# EAGLE design shield2 (EAGLE 6.1)
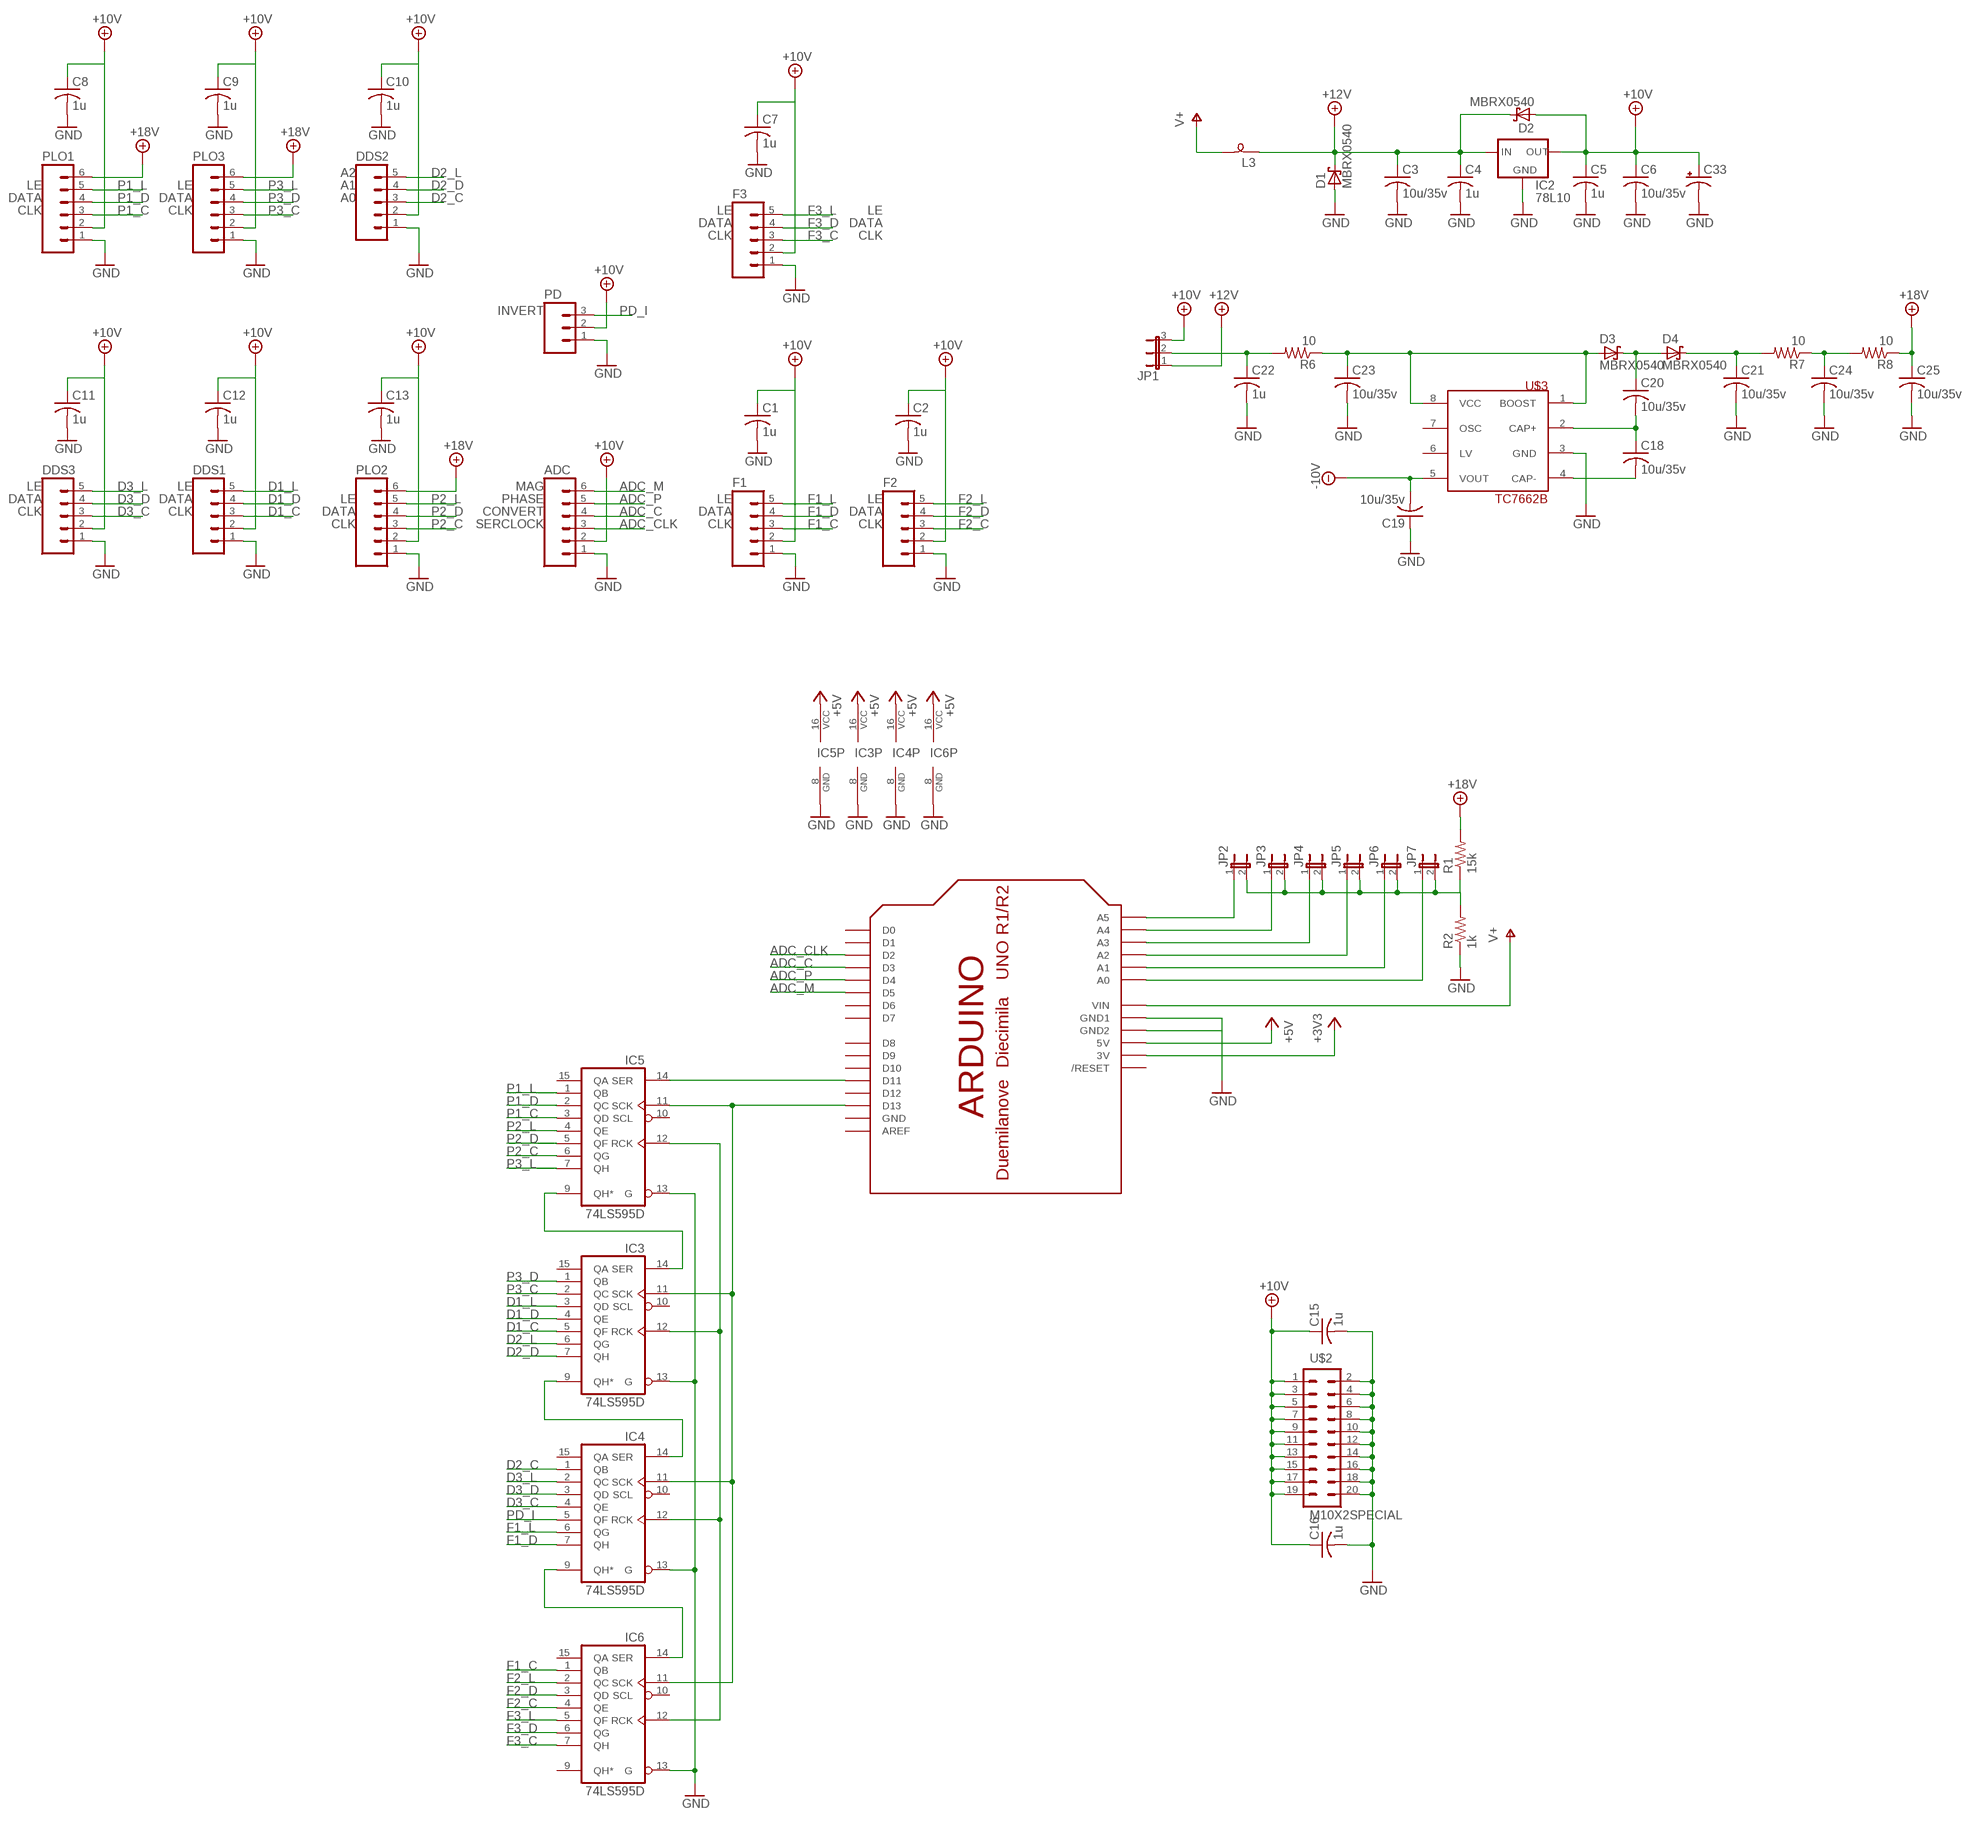
[diagram p0: schematic, sheet 1]

## Parts
ADC  M06LOCK  [1X06_LOCK]
C1  1u  C-USC0603  [C0603]
C2  1u  C-USC0603  [C0603]
C3  10u/35v  C-USC1206  [C1206]
C4  1u  C-USC0603  [C0603]
C5  1u  C-USC0603  [C0603]
C6  10u/35v  C-USC1206  [C1206]
C7  1u  C-USC0603  [C0603]
C8  1u  C-USC0603  [C0603]
C9  1u  C-USC0603  [C0603]
C10  1u  C-USC0603  [C0603]
C11  1u  C-USC0603  [C0603]
C12  1u  C-USC0603  [C0603]
C13  1u  C-USC0603  [C0603]
C15  1u  C-USC0603  [C0603]
C16  1u  C-USC0603  [C0603]
C18  10u/35v  C-USC1206  [C1206]
C19  10u/35v  C-USC1206  [C1206]
C20  10u/35v  C-USC1206  [C1206]
C21  10u/35v  C-USC1206  [C1206]
C22  1u  C-USC0603  [C0603]
C23  10u/35v  C-USC1206  [C1206]
C24  10u/35v  C-USC1206  [C1206]
C25  10u/35v  C-USC1206  [C1206]
C33  CPOL-USE2.5-6  [E2,5-6]
D1  MBRX0540  [SOD323-R]
D2  MBRX0540  [SOD323-R]
D3  MBRX0540  [SOD323-R]
D4  MBRX0540  [SOD323-R]
DDS1  M05LOCK  [1X05_LOCK]
DDS2  M05LOCK  [1X05_LOCK]
DDS3  M05LOCK  [1X05_LOCK]
F1  M05LOCK  [1X05_LOCK]
F2  M05LOCK  [1X05_LOCK]
F3  M05LOCK  [1X05_LOCK]
IC2  78L10  78XXS  [78XXS]
IC3  74LS595D  [SO16]
IC4  74LS595D  [SO16]
IC5  74LS595D  [SO16]
IC6  74LS595D  [SO16]
JP1  JP2E  [JP2]
JP2  JUMPER-2SMD-NO  [SJ_2S-NO]
JP3  JUMPER-2SMD-NO  [SJ_2S-NO]
JP4  JUMPER-2SMD-NO  [SJ_2S-NO]
JP5  JUMPER-2SMD-NO  [SJ_2S-NO]
JP6  JUMPER-2SMD-NO  [SJ_2S-NO]
JP7  JUMPER-2SMD-NO  [SJ_2S-NO]
L3  SM-B5  [SM-B5]
PD  M03LOCK  [1X03_LOCK]
PLO1  M06LOCK  [1X06_LOCK]
PLO2  M06LOCK  [1X06_LOCK]
PLO3  M06LOCK  [1X06_LOCK]
R1  15k  R-US_R0603  [R0603]
R2  1k  R-US_R0603  [R0603]
R6  10  R-US_R0603  [R0603]
R7  10  R-US_R0603  [R0603]
R8  10  R-US_R0603  [R0603]
U$1  ARDUINO-NOHOLE  [ARDUINO-NOHOLE]
U$2  M10X2SPECIAL  [2X10_LOCK_SPECIAL]
U$3  TC7662B  [SO-08]

## Nets
+3V3: U$1.3V
+5V: IC3.16(VCC) IC4.16(VCC) IC5.16(VCC) IC6.16(VCC) U$1.5V
+10V: ADC.2 C1.1 C2.1 C5.1 C6.1 C7.1 C8.1 C9.1 C10.1 C11.1 C12.1 C13.1 C15.1 C16.1 C33.+ D2.A DDS1.2 DDS2.2 DDS3.2 F1.2 F2.2 F3.2 IC2.OUT JP1.3 PD.2 PLO1.2 PLO2.2 PLO3.2 U$2.1 U$2.3 U$2.5 U$2.7 U$2.9 U$2.11 U$2.13 U$2.15 U$2.17 U$2.19
+12V: C3.1 C4.1 D1.C D2.C IC2.IN JP1.1 L3.1
+18V: C25.1 PLO1.6 PLO2.6 PLO3.6 R1.2 R8.1
-10V: C19.2 U$3.5(VOUT)
ADC_C: ADC.4 U$1.D3
ADC_CLK: ADC.3 U$1.D2
ADC_M: ADC.6 U$1.D5
ADC_P: ADC.5 U$1.D4
D1_C: DDS1.3 IC3.5(QF)
D1_D: DDS1.4 IC3.4(QE)
D1_L: DDS1.5 IC3.3(QD)
D2_C: DDS2.3 IC4.1(QB)
D2_D: DDS2.4 IC3.7(QH)
D2_L: DDS2.5 IC3.6(QG)
D3_C: DDS3.3 IC4.4(QE)
D3_D: DDS3.4 IC4.3(QD)
D3_L: DDS3.5 IC4.2(QC)
F1_C: F1.3 IC6.1(QB)
F1_D: F1.4 IC4.7(QH)
F1_L: F1.5 IC4.6(QG)
F2_C: F2.3 IC6.4(QE)
F2_D: F2.4 IC6.3(QD)
F2_L: F2.5 IC6.2(QC)
F3_C: F3.3 IC6.7(QH)
F3_D: F3.4 IC6.6(QG)
F3_L: F3.5 IC6.5(QF)
GND: ADC.1 C1.2 C2.2 C3.2 C4.2 C5.2 C6.2 C7.2 C8.2 C9.2 C10.2 C11.2 C12.2 C13.2 C15.2 C16.2 C19.1 C21.2 C22.2 C23.2 C24.2 C25.2 C33.- D1.A DDS1.1 DDS2.1 DDS3.1 F1.1 F2.1 F3.1 IC2.GND IC3.8(GND) IC3.13(G) IC4.8(GND) IC4.13(G) IC5.8(GND) IC5.13(G) IC6.8(GND) IC6.13(G) PD.1 PLO1.1 PLO2.1 PLO3.1 R2.1 U$1.GND1 U$1.GND2 U$2.2 U$2.4 U$2.6 U$2.8 U$2.10 U$2.12 U$2.14 U$2.16 U$2.18 U$2.20 U$3.3(GND)
N$1: IC5.14(SER) U$1.D11
N$2: IC3.11(SCK) IC4.11(SCK) IC5.11(SCK) IC6.11(SCK) U$1.D13
N$3: IC3.12(RCK) IC4.12(RCK) IC5.12(RCK) IC6.12(RCK)
N$4: IC3.14(SER) IC5.9(QH*)
N$5: IC3.9(QH*) IC4.14(SER)
N$6: IC4.9(QH*) IC6.14(SER)
N$8: JP2.1 U$1.A5
N$9: JP3.1 U$1.A4
N$10: JP4.1 U$1.A3
N$11: JP5.1 U$1.A2
N$12: JP6.1 U$1.A1
N$13: JP7.1 U$1.A0
N$14: JP2.2 JP3.2 JP4.2 JP5.2 JP6.2 JP7.2 R1.1 R2.2
N$18: C22.1 JP1.2 R6.2
N$19: C23.1 D3.A R6.1 U$3.1(BOOST) U$3.8(VCC)
N$20: C18.2 U$3.4(CAP-)
N$21: C18.1 C20.2 U$3.2(CAP+)
N$22: C20.1 D3.C D4.A
N$23: C21.1 D4.C R7.2
N$24: C24.1 R7.1 R8.2
P1_C: IC5.3(QD) PLO1.3
P1_D: IC5.2(QC) PLO1.4
P1_L: IC5.1(QB) PLO1.5
P2_C: IC5.6(QG) PLO2.3
P2_D: IC5.5(QF) PLO2.4
P2_L: IC5.4(QE) PLO2.5
P3_C: IC3.2(QC) PLO3.3
P3_D: IC3.1(QB) PLO3.4
P3_L: IC5.7(QH) PLO3.5
PD_I: IC4.5(QF) PD.3
V+: L3.2 U$1.VIN
Unconnected: IC3.10(SCL) IC3.15(QA) IC4.10(SCL) IC4.15(QA) IC5.10(SCL) IC5.15(QA) IC6.9(QH*) IC6.10(SCL) IC6.15(QA) U$1.AREF U$1.D0 U$1.D1 U$1.D6 U$1.D7 U$1.D8 U$1.D9 U$1.D10 U$1.D12 U$1.RESET(/RESET) U$3.6(LV) U$3.7(OSC)

## Notes on the sheet
- A2
- LE | LE | A1
- DATA | DATA | A0
- CLK | CLK | LE | LE
- DATA | DATA
- CLK | CLK
- INVERT
- LE | LE | MAG
- DATA | DATA | LE | PHASE | LE | LE
- CLK | CLK | DATA | CONVERT | DATA | DATA
- CLK | SERCLOCK | CLK | CLK

## Power pins joined to a net without a drawn wire
GND: U$1.GND

## Library data of the parts
ADC PLO1-PLO3 = SparkFun:M06: Header 6 Standard 6-pin 0.1" header. Use with straight break away headers (SKU : PRT-00116), right angle break away headers (PRT-00553), swiss pins (PRT-00743), machine pins (PRT-00117), and female headers (PRT-00115). Molex polarized connector foot print use with SKU : PRT-08094 with associated crimp pins and housings. NOTES ON THE VARIANTS LOCK and LOCK_LONGPADS... This footprint was designed to help hold the alignment of a through-hole component (i.e. 6-pin header) while soldering it into place. You may notice that each hole has been shifted either up or down by 0.005 of an inch from it's more standard position (which is a perfectly straight line). This slight alteration caused the pins (the squares in the middle) to touch the edges of the holes. Because they are alternating, it causes a "brace" to hold the component in place. 0.005 has proven to be the perfect amount of "off-center" position when using our standard breakaway headers. Although looks a little odd when you look at the bare footprint, once you have a header in there, the alteration is very hard to notice. Also, if you push a header all the way into place, it is covered up entirely on the bottom side. This idea of altering the position of holes to aid alignment will be further integrated into the Sparkfun Library for other footprints. It can help hold any component with 3 or more connection pins.
C1-C13 C15 C16 C18-C25 = rcl:C-US: CAPACITOR, American symbol
C33 = rcl:CPOL-US: POLARIZED CAPACITOR, American symbol
D1-D4 = Misc:MBRX0540
DDS1-DDS3 F1-F3 = SparkFun:M05: Header 5 Standard 5-pin 0.1" header. Use with straight break away headers (SKU : PRT-00116), right angle break away headers (PRT-00553), swiss pins (PRT-00743), machine pins (PRT-00117), and female headers (PRT-00115). Molex polarized connector foot print use with SKU : PRT-08230 with associated crimp pins and housings.
IC2 = v-reg:78XXS: VOLTAGE REGULATOR
IC3-IC6 = 74xx-us:74*595: 8-bit SHIFT REGISTER, output latch
JP1 = jumper:JP2E: JUMPER
JP2-JP7 = SparkFun:JUMPER-2: Jumper Basic 0.1" spaced jumper. Use with breakaway headers.
L3 = inductor-neosid:SM-B: INDUCTOR SMD Bead inductor; OC_FARNELL: unknown; OC_NEWARK: unknown
PD = SparkFun:M03: Header 3 Standard 3-pin 0.1" header. Use with straight break away headers (SKU : PRT-00116), right angle break away headers (PRT-00553), swiss pins (PRT-00743), machine pins (PRT-00117), and female headers (PRT-00115). Molex polarized connector foot print use with SKU : PRT-08232 with associated crimp pins and housings.
R1 R2 R6-R8 = rcl:R-US_: RESISTOR, American symbol
U$1 = adafruit:ARDUINO: Arduino Diecimila/Duemilanove Make a shield with ease, this package has all the named pins as well as the two mounting drill holes and an outline of the USB and DC power connector. The outline is on the DIMENSION layer, so if your board house uses it they will cut the outline to match. http://www.ladyada.net/library/pcb/eaglelibrary.html
U$2 = SparkFun:M10X2: This was SPECIALLY designed to be used with our Graphic LCD Backpack. Be sure you want to use this! It is not only staggered on each line of header holes, but IT IS ALSO offset of the center point of the top and bottom lines by 5 mil. This causes the headers to lock into place on the "standard" footprint on the LCD screen. The extra squares on the tdocu layer are there simply to reference other pins (if you were to actually populate a longer header than ten long - this is what we do with the backpacks).
U$3 = microchip:TC7662B

## Board
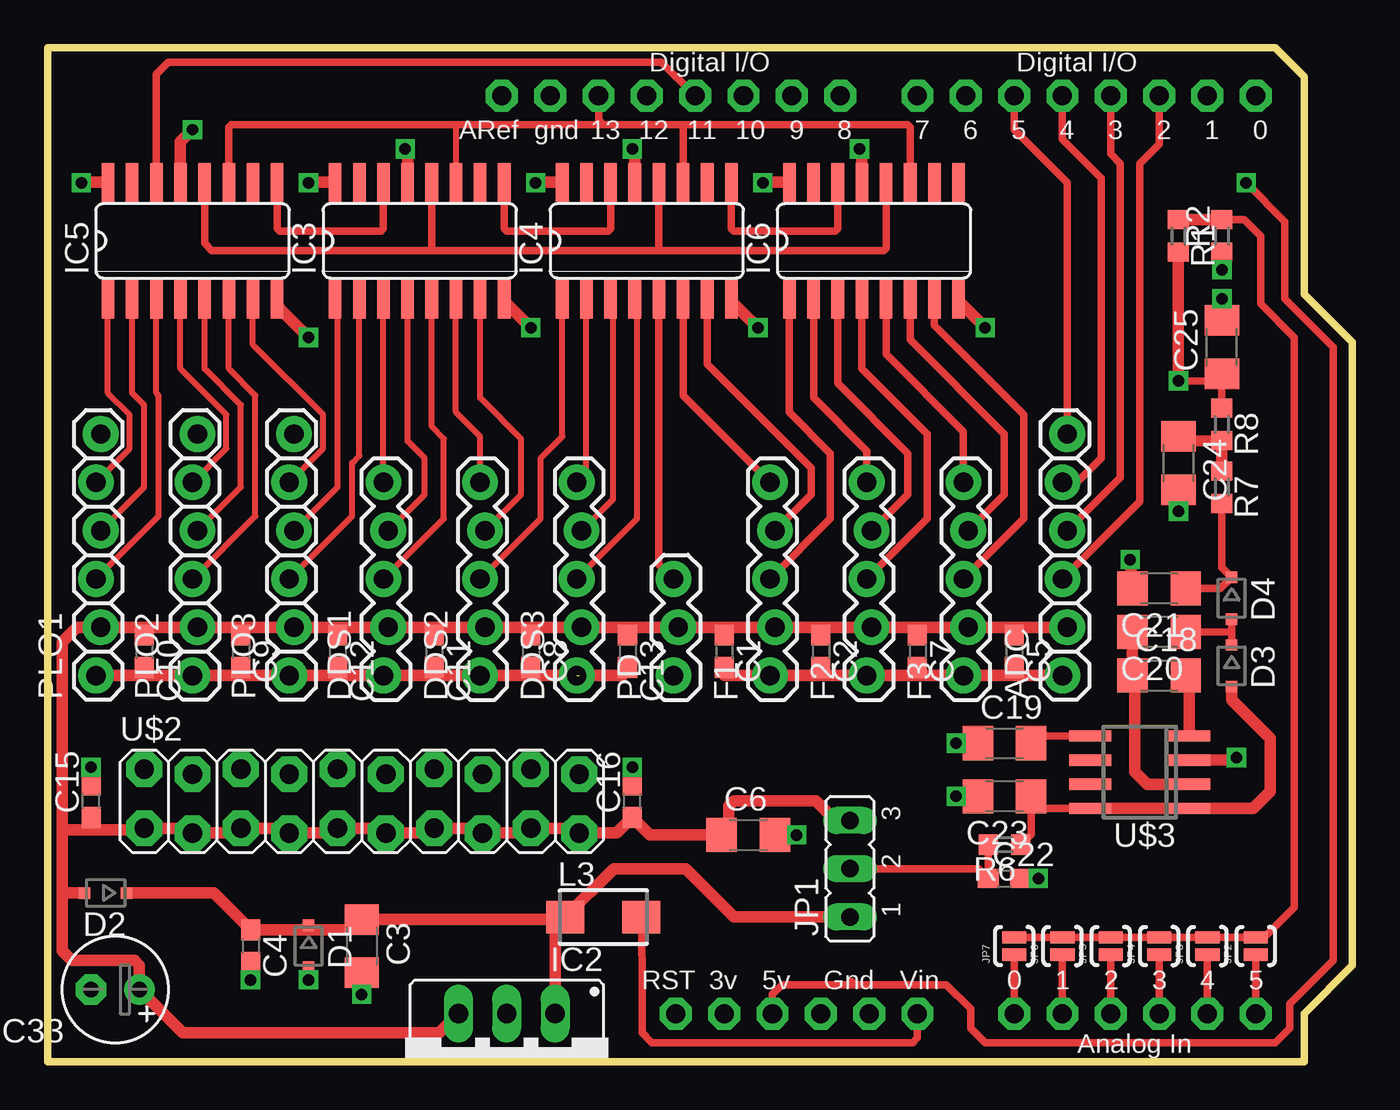
[diagram p1: board, top side]
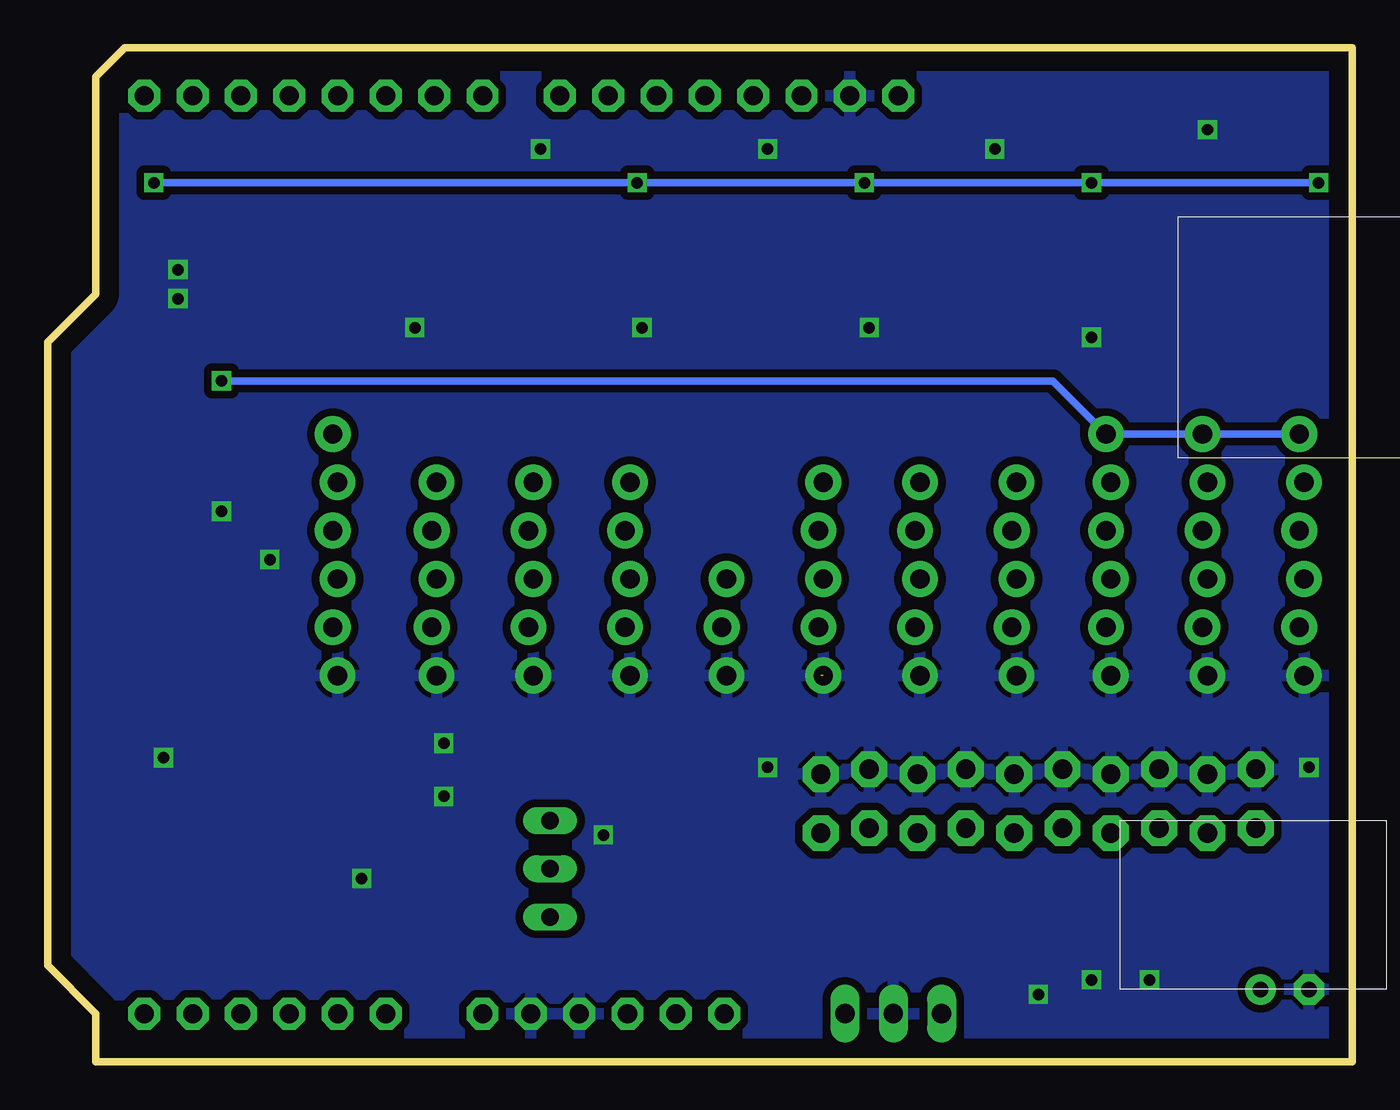
[diagram p2: board, bottom side, seen from below]

Size 68.58 x 53.34 mm. Coordinates in mm from the lower left corner, seen from the top.
Outline: 0,53.34 64.52,53.34 66.04,51.82 66.04,40.39 68.58,37.85 68.58,5.08 66.04,2.54 66.04,0 0,0 0,53.34
Copper layers (1*16): Top 0.035mm / dielectric 1.5mm / Bottom 0.035mm
Design rules: minimum track width 10mil, minimum drill 24mil, track to track 8mil, track to pad 8mil, pad to pad 8mil, via to via 8mil, smd to smd 8mil, copper to edge 40mil, drill to drill 8mil, minimum pad ring 10mil, minimum via ring 8mil, stop-mask expansion 4mil, vias tented up to drill 0mil, thermal gap 10mil

### Footprints (pad centres in the part's own frame; a part is rotated, then mirrored left to right if it is on the bottom)
1X06_LOCK = drill 1.016 pad 1.88: 1 0,0; 2 2.54,-0.254; 3 5.08,0; 4 7.62,-0.254; 5 10.16,0; 6 12.7,-0.254
C0603 = smd 1.1 x 1: 1 -0.85,0; 2 0.85,0
C1206 = smd 1.6 x 1.8: 1 -1.4,0; 2 1.4,0
E2,5-6 = drill 0.813 pad 1.6: + -1.27,0 | drill 0.813 pad 1.6 octagon: - 1.27,0
SOD323-R = smd 0.6 x 0.6: A 1.1,0; C -1.1,0
1X05_LOCK = drill 1.016 pad 1.88: 1 0,0.127; 2 2.54,-0.127; 3 5.08,0.127; 4 7.62,-0.127; 5 10.16,0.127
78XXS = drill 1.016 long: GND 0,-2.54; IN -2.54,-2.54; OUT 2.54,-2.54
SO16 = smd 0.66 x 2.032: 1 -4.445,-3.073; 2 -3.175,-3.073; 3 -1.905,-3.073; 4 -0.635,-3.073; 5 0.635,-3.073; 6 1.905,-3.073; 7 3.175,-3.073; 8 4.445,-3.073; 9 4.445,3.073; 10 3.175,3.073; 11 1.905,3.073; 12 0.635,3.073; 13 -0.635,3.073; 14 -1.905,3.073; 15 -3.175,3.073; 16 -4.445,3.073
JP2 = drill 0.914 long: 1 -2.54,0; 2 0,0; 3 2.54,0
SJ_2S-NO = smd 0.635 x 1.27: 1 -0.45,0; 2 0.45,0
SM-B5 = smd 2 x 1.7: 1 -2,0; 2 2,0
1X03_LOCK = drill 1.016 pad 1.88: 1 0,0.127; 2 2.54,-0.127; 3 5.08,0.127
R0603 = smd 1 x 1.1: 1 -0.85,0; 2 0.85,0
ARDUINO-NOHOLE = drill 1 pad 1.676 octagon: 3V 35.56,2.54; 5V 38.1,2.54; A0 50.8,2.54; A1 53.34,2.54; A2 55.88,2.54; A3 58.42,2.54; A4 60.96,2.54; A5 63.5,2.54; AREF 23.876,50.8; D0 63.5,50.8; D1 60.96,50.8; D2 58.42,50.8; D3 55.88,50.8; D4 53.34,50.8; D5 50.8,50.8; D6 48.26,50.8; D7 45.72,50.8; D8 41.656,50.8; D9 39.116,50.8; D10 36.576,50.8; D11 34.036,50.8; D12 31.496,50.8; D13 28.956,50.8; GND 26.416,50.8; GND1 43.18,2.54; GND2 40.64,2.54; RESET 33.02,2.54; VIN 45.72,2.54
2X10_LOCK_SPECIAL = drill 1.016 pad 1.88 octagon: 1 -11.43,-1.422; 2 -11.43,1.676; 3 -8.89,-1.676; 4 -8.89,1.422; 5 -6.35,-1.422; 6 -6.35,1.676; 7 -3.81,-1.676; 8 -3.81,1.422; 9 -1.27,-1.422; 10 -1.27,1.676; 11 1.27,-1.676; 12 1.27,1.422; 13 3.81,-1.422; 14 3.81,1.676; 15 6.35,-1.676; 16 6.35,1.422; 17 8.89,-1.422; 18 8.89,1.676; 19 11.43,-1.676; 20 11.43,1.422
SO-08 = smd 0.6 x 2.2: 1 -1.905,-2.6; 2 -0.635,-2.6; 3 0.635,-2.6; 4 1.905,-2.6; 5 1.905,2.6; 6 0.635,2.6; 7 -0.635,2.6; 8 -1.905,2.6

### Placement (x,y rotation side)
ADC  53.34,20.32 90 top
C1  35.56,21.59 270 top
C2  40.64,21.59 270 top
C3  16.51,6.1 270 top
C4  10.67,6.1 270 top
C5  50.8,21.59 270 top
C6  36.83,11.94 0 top
C7  45.72,21.59 270 top
C8  25.4,21.59 270 top
C9  10.16,21.59 270 top
C10  5.08,21.59 270 top
C11  20.32,21.59 270 top
C12  15.24,21.59 270 top
C13  30.48,21.59 270 top
C15  2.29,13.72 90 top
C16  30.73,13.72 90 top
C18  58.42,20.32 0 top
C19  50.29,16.76 0 top
C20  58.42,22.61 180 top
C21  58.42,24.89 180 top
C22  50.29,9.65 0 top
C23  50.29,13.97 180 top
C24  59.44,31.5 270 top
C25  61.72,37.59 90 top
C33  3.56,3.81 180 top
D1  13.72,6.1 270 top
D2  3.05,8.89 180 top
D3  62.23,20.83 270 top
D4  62.23,24.38 270 top
DDS1  17.78,20.32 90 top
DDS2  22.86,20.32 90 top
DDS3  27.94,20.32 90 top
F1  38.1,20.32 90 top
F2  43.18,20.32 90 top
F3  48.26,20.32 90 top
IC2  24.13,0 180 top
IC3  19.56,43.18 0 top
IC4  31.5,43.18 0 top
IC5  7.62,43.18 0 top
IC6  43.43,43.18 0 top
JP1  42.16,10.16 90 top
JP2  63.5,6.1 90 top
JP3  60.96,6.1 90 top
JP4  58.42,6.1 90 top
JP5  55.88,6.1 90 top
JP6  53.34,6.1 90 top
JP7  50.8,6.1 90 top
L3  29.21,7.62 0 top
PD  33.02,20.32 90 top
PLO1  2.54,20.32 90 top
PLO2  7.62,20.32 90 top
PLO3  12.7,20.32 90 top
R1  59.44,43.43 270 top
R2  61.72,43.43 90 top
R6  50.29,11.43 180 top
R7  61.72,30.23 270 top
R8  61.72,33.53 270 top
U$1  0,0 0 top
U$2  16.51,13.72 0 top
U$3  57.4,15.24 90 top

### Tracks (layer width: path | path; a pad name or v marks a point on that pad's centre or on a via)
+5V  (via drill 0.6)
  Top 0.406: v62.99,46.23 65.02,44.2 65.02,40.13 67.56,37.59 67.56,5.33 66.29,4.06 65.28,3.05 65.28,1.78 64.52,1.02 49.28,1.02 48.51,1.78 48.51,2.79 47.24,4.06 42.42,4.06 | U$1.5V 38.1,3.56 38.61,4.06 42.42,4.06 | 42.42,4.06 42.25,4.23
  Top 0.61: IC6.16 37.62,46.25 v37.59,46.23 | IC4.16 25.68,46.25 v25.65,46.23 | IC3.16 13.74,46.25 v13.72,46.23 | IC5.16 1.8,46.25 v1.78,46.23
  Bottom 0.406: v1.78,46.23 v13.72,46.23 v25.65,46.23 v37.59,46.23 v62.99,46.23
+10V
  Top 0.61: 5.08,22.86 PLO1.2 1.52,22.86 0.76,22.1 0.76,12.19 | 5.08,22.86 PLO2.2 10.16,22.86 | 10.16,22.86 PLO3.2 14.99,22.86 | 14.99,22.86 DDS1.2 20.32,22.86 | 20.32,22.86 DDS2.2 25.4,22.86 | 25.4,22.86 DDS3.2 30.23,22.86 | 35.56,22.86 F1.2 40.64,22.86 | 40.64,22.86 F2.2 45.47,22.86 | 45.47,22.86 F3.2 50.8,22.86 | C7.1 45.72,22.61 45.47,22.86 | 40.64,22.86 C2.1 | 35.56,22.86 C1.1 | C13.1 30.48,22.61 30.23,22.86 | 25.4,22.86 C8.1 | 20.32,22.86 C11.1 | C12.1 15.24,22.61 14.99,22.86 | 10.16,22.86 C9.1 | 5.08,22.86 C10.1 | 0.76,8.64 0.76,5.84 1.27,5.33 4.57,5.33 4.83,5.08 C33.+ 7.11,1.52 20.57,1.52 IC2.OUT | 0.76,8.64 0.76,12.19 | 2.29,12.19 C15.1 | 0.76,12.19 2.29,12.19 | 2.29,12.19 4.98,12.19 U$2.1 7.37,12.29 U$2.3 9.91,12.04 U$2.5 12.45,12.29 U$2.7 14.99,12.04 U$2.9 17.53,12.29 U$2.11 20.07,12.04 U$2.13 22.61,12.29 U$2.15 25.15,12.04 U$2.17 27.69,12.29 U$2.19 29.91,12.04 C16.1 31.66,11.94 C6.1 35.81,12.32 35.81,13.46 36.07,13.72 40.39,13.72 41.4,12.7 JP1.3 | D2.A 1.02,8.89 0.76,8.64 | 35.56,22.86 PD.2 30.23,22.86 | 50.8,22.86 ADC.2 | 50.8,22.86 C5.1
+12V
  Top 0.61: JP1.1 36.07,7.62 33.53,10.16 29.75,10.16 L3.1 27.09,7.5 | D2.C 8.72,8.89 C4.1 13.46,6.95 | 13.46,6.95 15.79,6.95 C3.1 27.09,7.5 | D1.C 13.46,6.95 | IC2.IN 26.67,6.9 27.09,7.5
+18V  (via drill 0.6)
  Top 0.406: v59.44,35.81 61.34,35.81 | 61.34,35.81 C25.1 | R8.1 61.72,35.44 61.34,35.81
  Top 0.61: v59.44,35.81 R1.2
  Bottom 0.406: PLO1.6 PLO2.6 PLO3.6 15.75,35.81 v59.44,35.81
-10V
  Top 0.406: U$3.5 52.07,17.14 C19.2
ADC_C
  Top 0.406: U$1.D3 55.88,47.75 56.39,47.24 56.39,30.73 ADC.4
ADC_CLK
  Top 0.406: U$1.D2 58.42,48.26 57.4,47.24 57.4,29.46 ADC.3
ADC_M
  Top 0.406: U$1.D5 50.8,49.02 53.59,46.23 ADC.6
ADC_P
  Top 0.406: U$1.D4 53.34,48.51 55.37,46.48 55.37,31.75 54.1,30.48 ADC.5
D1_C
  Top 0.305: IC3.5 20.19,33.4 20.83,32.77 20.83,28.57 DDS1.3
D1_D
  Top 0.305: IC3.4 18.92,32.64 19.81,31.75 19.81,29.84 DDS1.4
D1_L
  Top 0.305: DDS1.5 IC3.3
D2_C
  Top 0.305: IC4.1 27.05,32.89 25.91,31.75 25.91,28.57 DDS2.3
D2_D
  Top 0.305: IC3.7 22.73,34.92 24.89,32.77 24.89,29.84 DDS2.4
D2_L
  Top 0.305: IC3.6 21.46,34.16 22.73,32.89 DDS2.5
D3_C
  Top 0.305: IC4.4 30.86,39.5 30.99,39.37 30.99,28.57 DDS3.3
D3_D
  Top 0.305: IC4.3 29.59,39.5 29.72,39.37 29.72,29.59 DDS3.4
D3_L
  Top 0.305: IC4.2 28.32,31.11 27.81,30.61 DDS3.5
F1_C
  Top 0.406: IC6.1 38.99,34.16 41.15,32 41.15,28.57 F1.3
F1_D
  Top 0.406: IC4.7 34.67,36.7 40.13,31.24 40.13,29.84 F1.4
F1_L
  Top 0.406: IC4.6 33.4,35.05 F1.5
F2_C
  Top 0.406: IC6.4 42.8,36.45 46.23,33.02 46.23,28.57 F2.3
F2_D
  Top 0.406: IC6.3 41.53,35.69 45.21,32 45.21,29.84 F2.4
F2_L
  Top 0.406: IC6.2 40.26,34.92 43.05,32.13 F2.5
F3_C
  Top 0.406: IC6.7 46.61,38.73 51.31,34.04 51.31,28.57 F3.3
F3_D
  Top 0.406: IC6.6 45.34,37.97 50.29,33.02 50.29,29.84 F3.4
F3_L
  Top 0.406: IC6.5 44.07,37.21 48.13,33.15 F3.5
GND  (via drill 0.6)  (1 unrouted)
  Top 0.61: PLO1.1 5.33,20.32 | 5.33,20.32 PLO2.1 10.16,20.32 | 10.16,20.32 PLO3.1 15.24,20.32 | C10.2 5.08,20.57 5.33,20.32 | 10.16,20.32 C9.2 | 15.24,20.32 C12.2 | 15.24,20.32 20.32,20.32 | 20.32,20.32 DDS2.1 25.4,20.32 | 25.4,20.32 DDS3.1 | 20.32,20.32 C11.2 | 25.4,20.32 C8.2 | 27.94,20.32 30.23,20.32 30.48,20.57 C13.2 | 40.89,20.32 F1.1 35.56,20.32 C1.2 | 40.89,20.32 F2.1 45.97,20.32 | C2.2 40.64,20.57 40.89,20.32 | 45.97,20.32 F3.1 | C7.2 45.72,20.57 45.97,20.32 | C6.2 v39.37,11.94 | v10.67,4.32 C4.2 | D1.A v13.72,4.32 | C3.2 v16.51,3.56 | C16.2 v30.73,15.49 | C15.2 v2.29,15.49 | C22.2 v52.07,9.65 | v47.75,13.97 C23.2 | v47.75,16.76 C19.1 | U$3.3 62.36,15.88 v62.48,16 | C21.2 v56.9,26.42 | C24.2 v59.44,28.96 | C25.2 v61.72,40.13 | IC5.8 12.06,39.75 v13.72,38.1 | IC3.8 24,40.01 v25.4,38.61 | IC4.8 35.94,40.01 v37.34,38.61 | IC6.8 47.88,40.01 v49.28,38.61 | IC5.13 6.99,48.39 v7.62,49.02 | IC3.13 18.92,47.88 v18.8,48.01 | IC4.13 30.86,47.88 v30.73,48.01 | IC6.13 42.8,47.88 v42.67,48.01 | 48.26,20.32 50.8,20.32 | 50.8,20.32 ADC.1 | 50.8,20.32 C5.2 | R2.1 v61.72,41.66
  pour Bottom (isolate 0.406): 0,53.34 0,0 66.04,0 66.04,2.54 68.58,5.08 68.58,37.85 66.04,40.39 66.04,51.82 64.52,53.34
N$1
  Top 0.406: IC5.14 5.71,51.94 6.35,52.58 32.26,52.58 U$1.D11
N$2
  Top 0.305: IC3.11 21.46,49.15 21.34,49.28
  Top 0.406: IC4.11 33.4,49.15 33.27,49.28 | 29.21,49.28 21.34,49.28 9.65,49.28 9.53,49.15 IC5.11 | 29.21,49.28 33.27,49.28 | IC6.11 45.34,49.15 45.21,49.28 33.27,49.28 | U$1.D13 28.96,49.53 29.21,49.28
N$3
  Top 0.406: IC5.12 8.26,43.05 8.64,42.67 20.32,42.67 | 20.32,42.67 32,42.67 | IC4.12 32.13,42.8 32,42.67 | IC3.12 20.19,42.8 20.32,42.67 | IC6.12 44.07,42.8 43.94,42.67 32,42.67
N$4
  Top 0.406: IC5.9 12.06,43.81 12.19,43.69 17.53,43.69 17.65,43.81 IC3.14
N$5
  Top 0.406: IC3.9 24,43.81 24.13,43.69 29.46,43.69 29.59,43.81 IC4.14
N$6
  Top 0.406: IC6.14 41.53,43.81 41.4,43.69 36.07,43.69 35.94,43.81 IC4.9
N$8
  Top 0.406: U$1.A5 JP2.1
N$9
  Top 0.406: U$1.A4 JP3.1
N$10
  Top 0.406: U$1.A3 JP4.1
N$11
  Top 0.406: U$1.A2 JP5.1
N$12
  Top 0.406: U$1.A1 JP6.1
N$13
  Top 0.406: U$1.A0 JP7.1
N$14
  Top 0.406: JP7.2 JP6.2 JP5.2 JP4.2 JP3.2 JP2.2 63.95,6.55 65.53,8.13 65.53,32.6 65.53,38.1 63.75,39.88 63.75,43.43 62.9,44.28 R2.2
  Top 0.61: R2.2 R1.1
N$18
  Top 0.406: R6.2 C22.1 48.93,10.16 JP1.2
N$19
  Top 0.406: U$3.8 52.33,13.34 C23.1 51.69,11.98 R6.1
  Top 0.61: U$3.8 U$3.1 63.37,13.34 64.26,14.22 64.26,17.02 62.23,19.05 D3.A
N$20
  Top 0.61: U$3.4 60,20.14 C18.2
N$21
  Top 0.61: U$3.2 57.78,14.61 57.15,15.24 57.15,20.07 57.02,20.2 C18.1 C20.2
N$22
  Top 0.406: 62.23,22.61 D3.C | 62.23,22.61 D4.A | C20.1 62.23,22.61
N$23
  Top 0.406: R7.2 61.72,25.99 D4.C 61.64,24.89 C21.1
N$24
  Top 0.61: R7.1 R8.2 59.73,32.64 C24.1
P1_C
  Top 0.305: IC5.3 5.71,35.18 5.84,35.05 5.84,28.7 PLO1.3
P1_D
  Top 0.305: IC5.2 4.45,35.18 5.08,34.54 5.08,30.23 PLO1.4
P1_L
  Top 0.305: IC5.1 3.17,35.18 4.32,34.04 4.32,32.26 PLO1.5
P2_C
  Top 0.305: IC5.6 9.53,36.45 10.92,35.05 10.92,28.7 PLO2.3
P2_D
  Top 0.305: IC5.5 8.26,36.45 10.16,34.54 10.16,30.23 PLO2.4
P2_L
  Top 0.305: IC5.4 6.99,36.45 9.4,34.04 9.4,32.26 PLO2.5
P3_C
  Top 0.305: PLO3.3 16,28.7 16,31.5 16.38,31.88 IC3.2
P3_D
  Top 0.305: PLO3.4 15.24,30.23 15.24,39.98 IC3.1
P3_L
  Top 0.305: IC5.7 10.79,37.72 14.48,34.04 14.48,32.26 PLO3.5
PD_I
  Top 0.406: IC4.5 32.13,26.16 PD.3
V+
  Top 0.406: U$1.VIN 45.72,1.27 45.47,1.02 31.75,1.02 31.24,1.52 31.24,4.86 L3.2

### Text on the board
_tsilk: Digital I/O | Digital I/O | ARef | gnd | 13 | 12 | 11 | 10 | 9 | 8 | 7 | 6 | 5 | 4 | 3 | 2 | 1 | 0 | 74LS595D | 74LS595D | 74LS595D | 74LS595D | 74LS595D | PLO1 | PLO2 | PLO3 | ADC | DDS1 | DDS2 | DDS3 | F1 | F2 | F3 | F4 | PD | 10u/35v | 10u/35v | 10 | 10 | 10u/35v | 10u/35v | D4 | 10u/35v | 1u | 1u | 1u | D3 | 10u/35v | 10u/35v | 10 | 10u/35v | L3 | 10u/35v | D2 | 1u | D1 | 78L10 | TC7662B | RST | 3v | 5v | Gnd | Vin | 0 | 1 | 2 | 3 | 4 | 5 | C33 | Analog In
_bsilk: 1k | R2 | R1 | 15k | JP7 | JP6 | JP5 | JP4 | JP3 | JP2